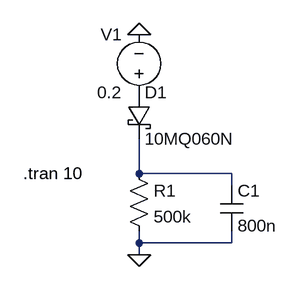
[diagram p0: schematic Draft2.asc]
Draft2.asc, the LTspice schematic file:
Version 4
SHEET 1 880 680
WIRE 160 272 160 224
WIRE 288 272 160 272
WIRE 288 288 288 272
WIRE 160 368 160 352
WIRE 288 368 288 352
WIRE 288 368 160 368
WIRE 160 384 160 368
FLAG 160 80 0
FLAG 160 384 0
SYMBOL voltage 160 176 R180
WINDOW 0 24 96 Left 2
WINDOW 3 24 16 Left 2
WINDOW 123 0 0 Left 0
WINDOW 39 0 0 Left 0
SYMATTR InstName V1
SYMATTR Value 0.2
SYMBOL schottky 144 160 R0
SYMATTR InstName D1
SYMATTR Value 10MQ060N
SYMATTR Description Diode
SYMATTR Type diode
SYMBOL res 144 256 R0
SYMATTR InstName R1
SYMATTR Value 500k
SYMBOL cap 272 288 R0
SYMATTR InstName C1
SYMATTR Value 800n
TEXT 0 272 Left 2 !.tran 10

The netlist it stands for:
* Draft2.asc
V1 P001 0 0.2
D1 P001 N001 10MQ060N
R1 N001 0 500k
C1 N001 0 800n
.model D D
.lib standard.dio
.tran 10
.backanno
.end